# EAGLE design CAN-Breakout2021_02 (EAGLE 9.6.1)
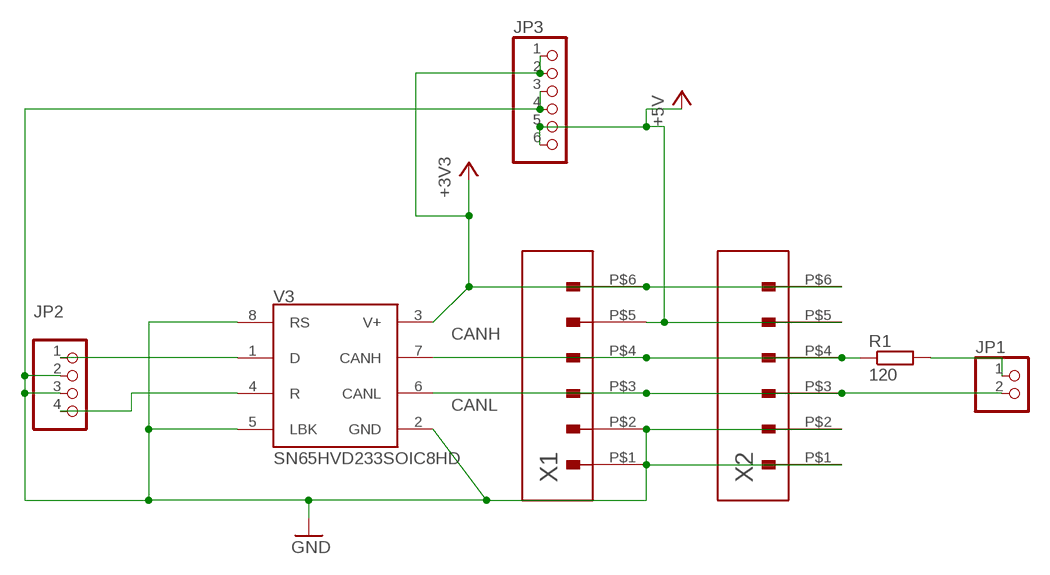
[diagram p0: schematic, sheet 1]

## Parts
JP1  PINHD-1X2/90  [1X02/90]
JP2  PINHD-1X4  [1X04]
JP3  PINHD-1X6  [1X06]
R1  120  R-EU_R0603  [R0603]
V3  SN65HVD233SOIC8HD  [SO08]
X1  MOLEX104078-0610  [MOLEX104078-0610]
X2  MOLEX104078-0610  [MOLEX104078-0610]

## Nets
+3V3: JP3.1 JP3.2 V3.3(V+) X1.P$6 X2.P$6
+5V: JP3.5 JP3.6 X1.P$5 X2.P$5
CANH: R1.1 V3.7(CANH) X1.P$4 X2.P$4
CANL: JP1.2 V3.6(CANL) X1.P$3 X2.P$3
GND: JP2.2 JP2.3 JP3.3 JP3.4 V3.2(GND) V3.5(LBK) V3.8(RS) X1.P$1 X1.P$2 X2.P$1 X2.P$2
N$1: JP1.1 R1.2
N$2: JP2.1 V3.1(D)
N$3: JP2.4 V3.4(R)

## Library data of the parts
JP1 = pinhead:PINHD-1X2: PIN HEADER
JP2 = pinhead:PINHD-1X4: PIN HEADER
JP3 = pinhead:PINHD-1X6: PIN HEADER
R1 = rcl:R-EU_: RESISTOR, European symbol; SPICEPREFIX: R
V3 = Treiber:SN65HVD233: CAN Transceiver, 3,3V
X1 X2 = Roboter:MOLEX104078-0610

## Board
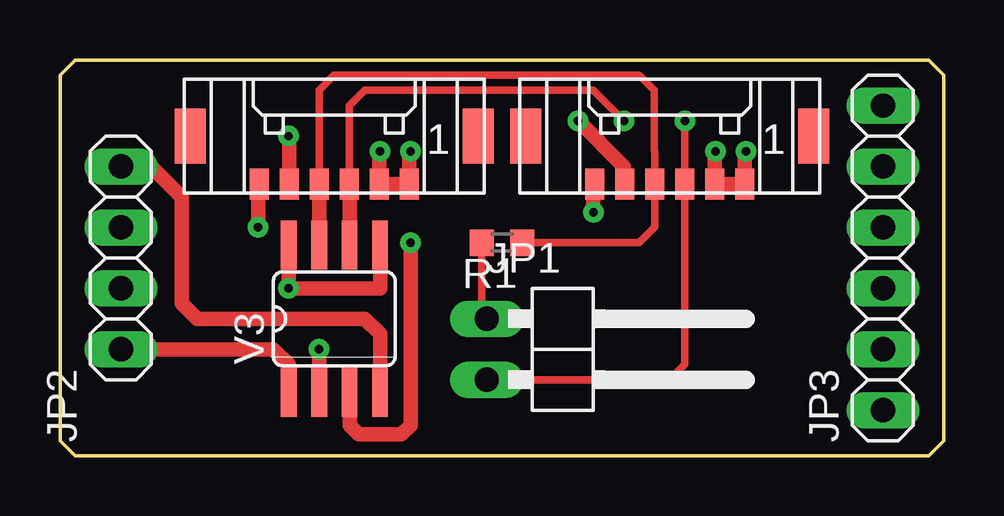
[diagram p1: board, top side]
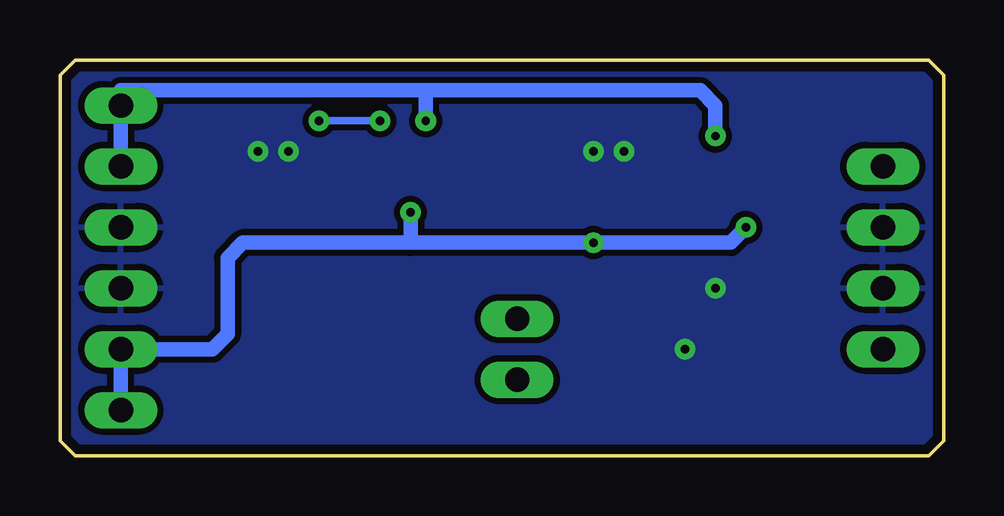
[diagram p2: board, bottom side, seen from below]

Size 36.83 x 16.51 mm. Coordinates in mm from the lower left corner, seen from the top.
Outline: 0,15.88 0,0.64 0.63,0 36.2,0 36.83,0.64 36.83,15.88 36.2,16.51 0.63,16.51 0,15.88
Copper layers (1*16): Top 0.035mm / dielectric 1.5mm / Bottom 0.035mm
Design rules "default *": minimum track width 10mil, minimum drill 8mil, track to track 10mil, track to pad 10mil, pad to pad 10mil, via to via 10mil, smd to smd 10mil, copper to edge 15mil, drill to drill 8mil, minimum pad ring 10mil, minimum via ring 10mil, stop-mask expansion 0mil, vias tented up to drill 0mil, thermal gap 10mil

### Footprints (pad centres in the part's own frame; a part is rotated, then mirrored left to right if it is on the bottom)
1X02/90 = drill 1.016 long: 1 -1.27,-3.81; 2 1.27,-3.81
1X04 = drill 1.016 long: 1 -3.81,0; 2 -1.27,0; 3 1.27,0; 4 3.81,0
1X06 = drill 1.016 long: 1 -6.35,0; 2 -3.81,0; 3 -1.27,0; 4 1.27,0; 5 3.81,0; 6 6.35,0
R0603 = smd 1 x 1.1: 1 -0.85,0; 2 0.85,0
SO08 = smd 0.66 x 2.032: 1 -1.905,-3.073; 2 -0.635,-3.073; 3 0.635,-3.073; 4 1.905,-3.073; 5 1.905,3.073; 6 0.635,3.073; 7 -0.635,3.073; 8 -1.905,3.073
MOLEX104078-0610 = smd 0.8 x 1.3: P$1 -3.125,2; P$2 -1.875,2; P$3 -0.625,2; P$4 0.625,2; P$5 1.875,2; P$6 3.125,2 | smd 1.3 x 2.3: P$7 -6,0; P$8 6,0

### Placement (x,y rotation side)
JP1  21.59,4.45 270 top
JP2  2.54,8.26 90 top
JP3  34.29,8.26 90 top
R1  18.41,8.89 180 top
V3  11.43,5.72 0 top
X1  11.43,13.34 180 top
X2  25.4,13.34 180 top

### Tracks (layer width: path | path; a pad name or v marks a point on that pad's centre or on a via)
+3V3  (via drill 0.35)
  Top 0.61: V3.3 12.06,1.27 12.45,0.89 14.22,0.89 14.6,1.27 v14.6,8.89 | X2.P$6 22.22,11.29 v22.22,10.16 | v8.25,9.53 8.25,11.29 X1.P$6
  Bottom 0.61: v8.25,9.53 8.89,8.89 v14.6,8.89 22.22,8.89 | 22.22,8.89 29.21,8.89 29.84,8.26 29.84,5.08 30.48,4.45 JP3.2 JP3.1 | v22.22,10.16 22.22,8.89
+5V  (via drill 0.35)
  Top 0.61: v9.52,13.34 9.55,13.3 X1.P$5 | X2.P$5 23.49,11.37 23.49,12.07 v21.59,13.97
  Bottom 0.61: 21.59,15.24 34.29,15.24 JP3.6 JP3.5 | 21.59,15.24 10.16,15.24 9.52,14.61 v9.52,13.34 | v21.59,13.97 21.59,15.24
CANH
  Top 0.305: X1.P$4 10.8,15.25 10.79,15.26 11.41,15.88 24.13,15.88 24.77,15.24 24.77,12.7 24.77,12.69 X2.P$4 24.77,9.54 24.13,8.89 R1.1
  Top 0.61: V3.7 X1.P$4
CANL  (via drill 0.35)
  Top 0.305: X1.P$3 12.05,14.6 12.7,15.24 22.22,15.24 v23.49,13.97 | v26.04,13.97 X2.P$3 26.04,3.81 25.4,3.18 JP1.2
  Top 0.61: V3.6 X1.P$3
  Bottom 0.305: v26.04,13.97 v23.49,13.97
GND  (via drill 0.35)
  Top 0.305: 13.3,12.67 v13.33,12.7 | v14.6,12.7 14.55,12.65 | 27.27,12.67 v27.3,12.7 | 28.52,12.65 v28.57,12.7
  Top 0.61: V3.2 v10.79,4.45 | V3.8 v9.52,6.99 13.33,6.99 V3.5 | 13.3,12.67 X1.P$2 X1.P$1 14.55,12.65 | 27.27,12.67 X2.P$2 X2.P$1 28.52,12.65
  pour Bottom: 37.47,17.78 38.1,17.15 38.1,-0.63 37.47,-1.27 -0.64,-1.27 -1.27,-0.63 -1.27,17.15 -0.64,17.78
N$1
  Top 0.305: JP1.1 17.56,5.93 R1.2
N$2
  Top 0.61: V3.1 9.52,3.81 8.89,4.45 JP2.1
N$3
  Top 0.61: V3.4 13.33,5.08 12.7,5.72 5.71,5.72 5.08,6.35 5.08,10.8 3.81,12.07 JP2.4